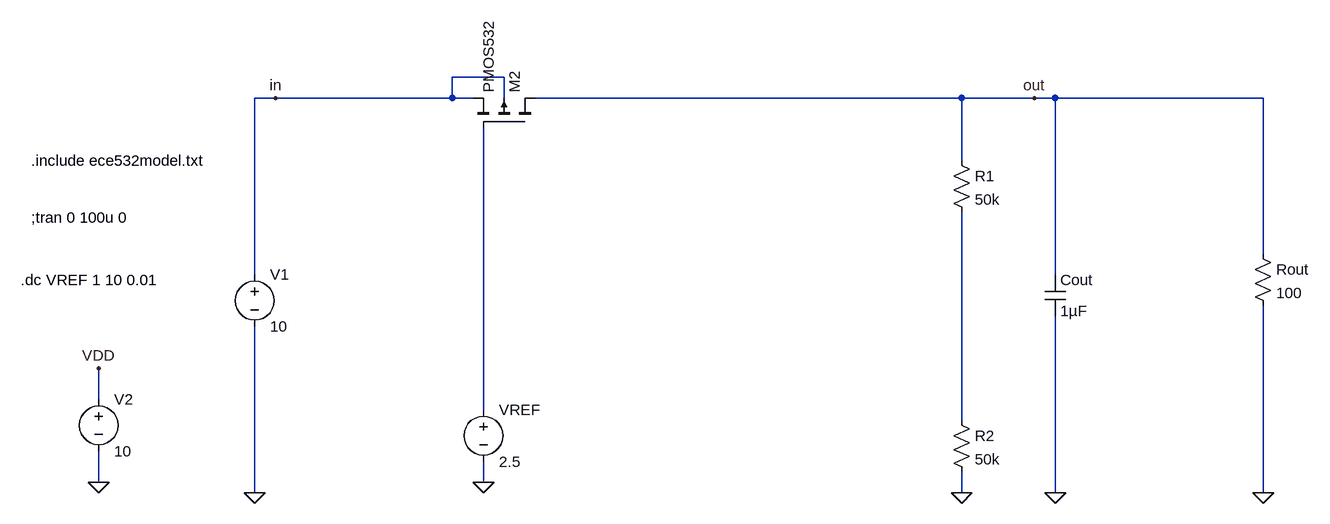
[diagram p0: schematic LDO_v0_ideal.asc]
LDO_v0_ideal.asc, the LTspice schematic file:
Version 4
SHEET 1 980 808
WIRE -272 64 -352 64
WIRE -624 96 -656 96
WIRE -352 96 -352 64
WIRE -352 96 -624 96
WIRE -320 96 -352 96
WIRE -272 96 -272 64
WIRE 432 96 -224 96
WIRE 544 96 432 96
WIRE 576 96 544 96
WIRE 896 96 576 96
WIRE 432 192 432 96
WIRE 896 336 896 96
WIRE -656 368 -656 96
WIRE 576 368 576 96
WIRE -896 560 -896 512
WIRE -304 576 -304 144
WIRE 432 592 432 272
WIRE -896 688 -896 640
WIRE -304 688 -304 656
WIRE -656 704 -656 448
WIRE 432 704 432 672
WIRE 576 704 576 432
WIRE 896 704 896 416
FLAG 432 704 0
FLAG 576 704 0
FLAG -304 688 0
FLAG -656 704 0
FLAG -624 96 in
FLAG 544 96 out
FLAG -896 688 0
FLAG -896 512 VDD
FLAG 896 704 0
SYMBOL res 416 176 R0
SYMATTR InstName R1
SYMATTR Value 50k
SYMBOL res 416 576 R0
SYMATTR InstName R2
SYMATTR Value 50k
SYMBOL cap 560 368 R0
SYMATTR InstName Cout
SYMATTR Value 1µF
SYMBOL voltage -304 560 R0
WINDOW 123 0 0 Left 2
WINDOW 39 0 0 Left 2
SYMATTR InstName VREF
SYMATTR Value 2.5
SYMBOL voltage -656 352 R0
WINDOW 123 0 0 Left 2
WINDOW 39 0 0 Left 2
SYMATTR InstName V1
SYMATTR Value 10
SYMBOL voltage -896 544 R0
WINDOW 123 0 0 Left 2
WINDOW 39 0 0 Left 2
SYMATTR InstName V2
SYMATTR Value 10
SYMBOL pmos4 -224 144 M270
SYMATTR InstName M2
SYMATTR Value PMOS532
SYMATTR Value2 l=1u w=1000u m=1
SYMBOL res 880 320 R0
SYMATTR InstName Rout
SYMATTR Value 100
TEXT -1000 280 Left 2 !;tran 0 100u 0
TEXT -1016 376 Left 2 !.dc VREF 1 10 0.01
TEXT -1000 192 Left 2 !.include ece532model.txt

The netlist it stands for:
* LDO_v0_ideal.asc
R1 out N002 50k
R2 N002 0 50k
Cout out 0 1µF
VREF N001 0 2.5
V1 in 0 10
V2 VDD 0 10
M2 out N001 in in PMOS532 l=1u w=1000u m=1
Rout out 0 100
.model NMOS NMOS
.model PMOS PMOS
.lib standard.mos
;tran 0 100u 0
.dc VREF 1 10 0.01
.include ece532model.txt
.backanno
.end